# EAGLE design TinyCube12b_Lib (EAGLE 7.5.0)
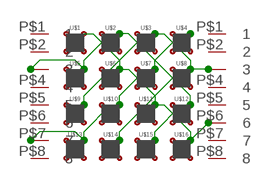
[diagram p0: schematic, sheet 1]

## Parts
U$1  PILLAR  [10MIL]
U$2  PILLAR  [10MIL]
U$3  PILLAR  [10MIL]
U$4  PILLAR  [10MIL]
U$5  PILLAR  [10MIL]
U$6  PILLAR  [10MIL]
U$7  PILLAR  [10MIL]
U$8  PILLAR  [10MIL]
U$9  PILLAR  [10MIL]
U$10  PILLAR  [10MIL]
U$11  PILLAR  [10MIL]
U$12  PILLAR  [10MIL]
U$13  PILLAR  [10MIL]
U$14  PILLAR  [10MIL]
U$15  PILLAR  [10MIL]
U$16  PILLAR  [10MIL]
U$17  TINY_HEADER_DEV  [TINY_HEADER_PKG]
U$18  TINY_HEADER_DEV  [TINY_HEADER_PKG]

## Nets
N$1: U$2.+(G) U$5.+(G) U$12.+(G) U$15.+(G) U$17.P$3
N$2: U$4.+(G) U$7.+(G) U$10.+(G) U$13.+(G) U$17.P$7
N$3: U$1.+(G) U$6.+(G) U$11.+(G) U$16.+(G) U$18.P$6
N$4: U$3.+(G) U$8.+(G) U$9.+(G) U$14.+(G) U$18.P$3
Unconnected: U$1.B(R) U$1.G(A) U$1.R(B) U$2.B(R) U$2.G(A) U$2.R(B) U$3.B(R) U$3.G(A) U$3.R(B) U$4.B(R) U$4.G(A) U$4.R(B) U$5.B(R) U$5.G(A) U$5.R(B) U$6.B(R) U$6.G(A) U$6.R(B) U$7.B(R) U$7.G(A) U$7.R(B) U$8.B(R) U$8.G(A) U$8.R(B) U$9.B(R) U$9.G(A) U$9.R(B) U$10.B(R) U$10.G(A) U$10.R(B) U$11.B(R) U$11.G(A) U$11.R(B) U$12.B(R) U$12.G(A) U$12.R(B) U$13.B(R) U$13.G(A) U$13.R(B) U$14.B(R) U$14.G(A) U$14.R(B) U$15.B(R) U$15.G(A) U$15.R(B) U$16.B(R) U$16.G(A) U$16.R(B) U$17.P$1 U$17.P$2 U$17.P$4 U$17.P$5 U$17.P$6 U$17.P$8 U$18.P$1 U$18.P$2 U$18.P$4 U$18.P$5 U$18.P$7 U$18.P$8

## Library data of the parts
U$1-U$16 = PILLAR:PILLAR
U$17 U$18 = TinyHeader:TINY_HEADER_DEV

## Board
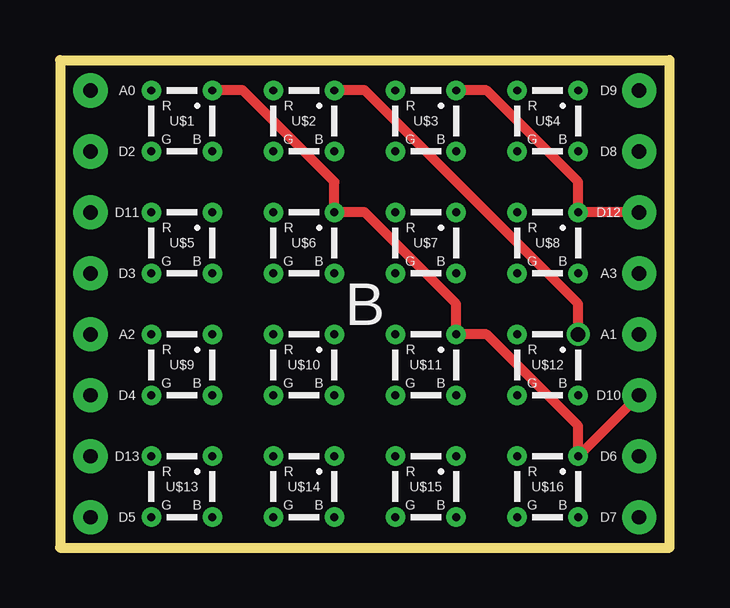
[diagram p1: board, top side]
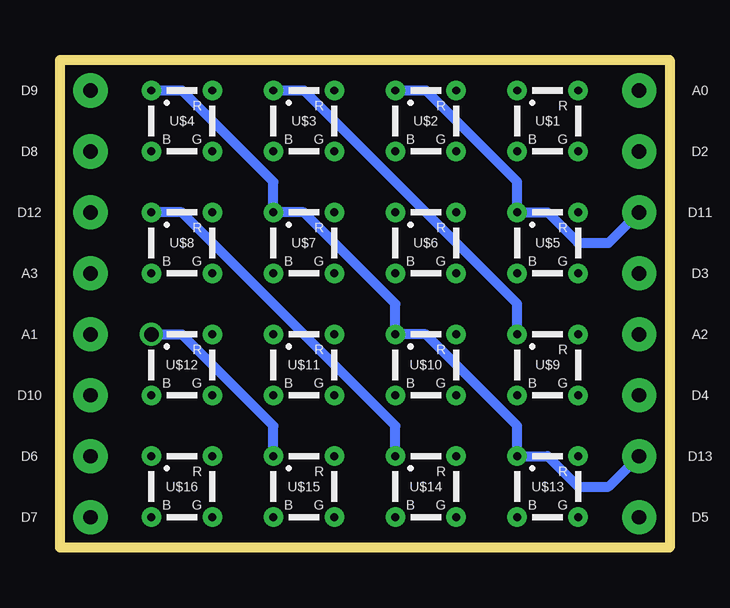
[diagram p2: board, bottom side, seen from below]

Size 25.4 x 20.32 mm. Coordinates in mm from the lower left corner, seen from the top.
Outline: 25.4,0 25.4,0
Outline: 25.4,0 25.4,20.31 0,20.31
Outline: 25.4,0 0,0 0,20.32 25.4,20.32 25.4,0
Copper layers (1*16): Top 0.0356mm / dielectric 1.5011mm / Bottom 0.0356mm
Design rules "LaenPCBOrder": minimum track width 6mil, minimum drill 13mil, track to track 6mil, track to pad 6mil, pad to pad 6mil, via to via 6mil, smd to smd 6mil, copper to edge 15mil, drill to drill 6mil, minimum pad ring 7mil, minimum via ring 7mil, stop-mask expansion 3mil, vias tented up to drill 0mil, thermal gap 10mil

### Footprints (pad centres in the part's own frame; a part is rotated, then mirrored left to right if it is on the bottom)
10MIL = drill 0.33 pad 0.813: + 1.27,1.27; B 1.27,-1.27; G -1.27,-1.27; R -1.27,1.27
TINY_HEADER_PKG = drill 0.6 pad 1.422: P$1 0,0; P$2 0,-2.54; P$3 0,-5.08; P$4 0,-7.62; P$5 0,-10.16; P$6 0,-12.7; P$7 0,-15.24; P$8 0,-17.78

### Placement (x,y rotation side)
U$1  5.08,17.78 0 top
U$2  10.16,17.78 0 top
U$3  15.24,17.78 0 top
U$4  20.32,17.78 0 top
U$5  5.08,12.7 0 top
U$6  10.16,12.7 0 top
U$7  15.24,12.7 0 top
U$8  20.32,12.7 0 top
U$9  5.08,7.62 0 top
U$10  10.16,7.62 0 top
U$11  15.24,7.62 0 top
U$12  20.32,7.62 0 top
U$13  5.08,2.54 0 top
U$14  10.16,2.54 0 top
U$15  15.24,2.54 0 top
U$16  20.32,2.54 0 top
U$17  1.27,19.05 0 top
U$18  24.13,19.05 0 top

### Tracks (layer width: path | path; a pad name or v marks a point on that pad's centre or on a via)
N$1  (via drill 0.6 pad 0.61)
  Top 0.406: U$12.+ 21.59,10.16 12.7,19.05 U$2.+
  Bottom 0.406: U$2.+ 10.16,19.05 6.35,15.24 U$5.+ 5.08,13.97 3.81,12.7 2.54,12.7 U$17.P$3 | U$15.+ 16.51,5.08 20.32,8.89 U$12.+
  other vias: 21.59,8.89
N$2
  Bottom 0.406: U$4.+ 20.32,19.05 16.51,15.24 U$7.+ 15.24,13.97 11.43,10.16 U$10.+ 10.16,8.89 6.35,5.08 U$13.+ 5.08,3.81 3.81,2.54 2.54,2.54 U$17.P$7
N$3
  Top 0.406: U$1.+ 7.62,19.05 11.43,15.24 U$6.+ 12.7,13.97 16.51,10.16 U$11.+ 17.78,8.89 21.59,5.08 U$16.+ U$18.P$6
N$4  (via drill 0.33)
  Top 0.406: U$3.+ 17.78,19.05 21.59,15.24 U$8.+ U$18.P$3
  Bottom 0.406: U$9.+ 6.35,10.16 15.24,19.05 U$3.+ | U$14.+ 11.43,5.08 20.32,13.97 U$8.+
  other vias: 21.59,13.97

### Text on the board
tNames: A0 | D9 | D2 | D8 | D11 | D12 | D3 | A3 | B | A2 | A1 | D4 | D10 | D13 | D6 | D5 | D7
bNames: A0 | D9 | D2 | D8 | D11 | D12 | D3 | A3 | A2 | A1 | D4 | D10 | D13 | D6 | D5 | D7